# Altium schematic sheet 06_Input_1-3.SchDoc: -
size A3; Date: -; ApprovedBy: -; CheckedBy: -; Author: -; CompanyName: -; DrawnBy: -; Engineer: -; Organization: Komax AG; Address1: -; Address2: -; Address3: -; Address4: -; DocumentNumber: -; Revision: -; SheetNumber: 6; SheetTotal: 8; KSDP_ObjectName: Input 1-3; KSDP_CreatedBy: Patrick Rossacher; KSDP_CreationDate: 18.12.2017; KSDP_ModificationDate: -; KSDP_ModifiedBy: -; CurrentTime: -; CurrentDate: -; Time: -; DocumentFullPathAndName: -; DocumentName: -; ModifiedDate: -; ImagePath: -
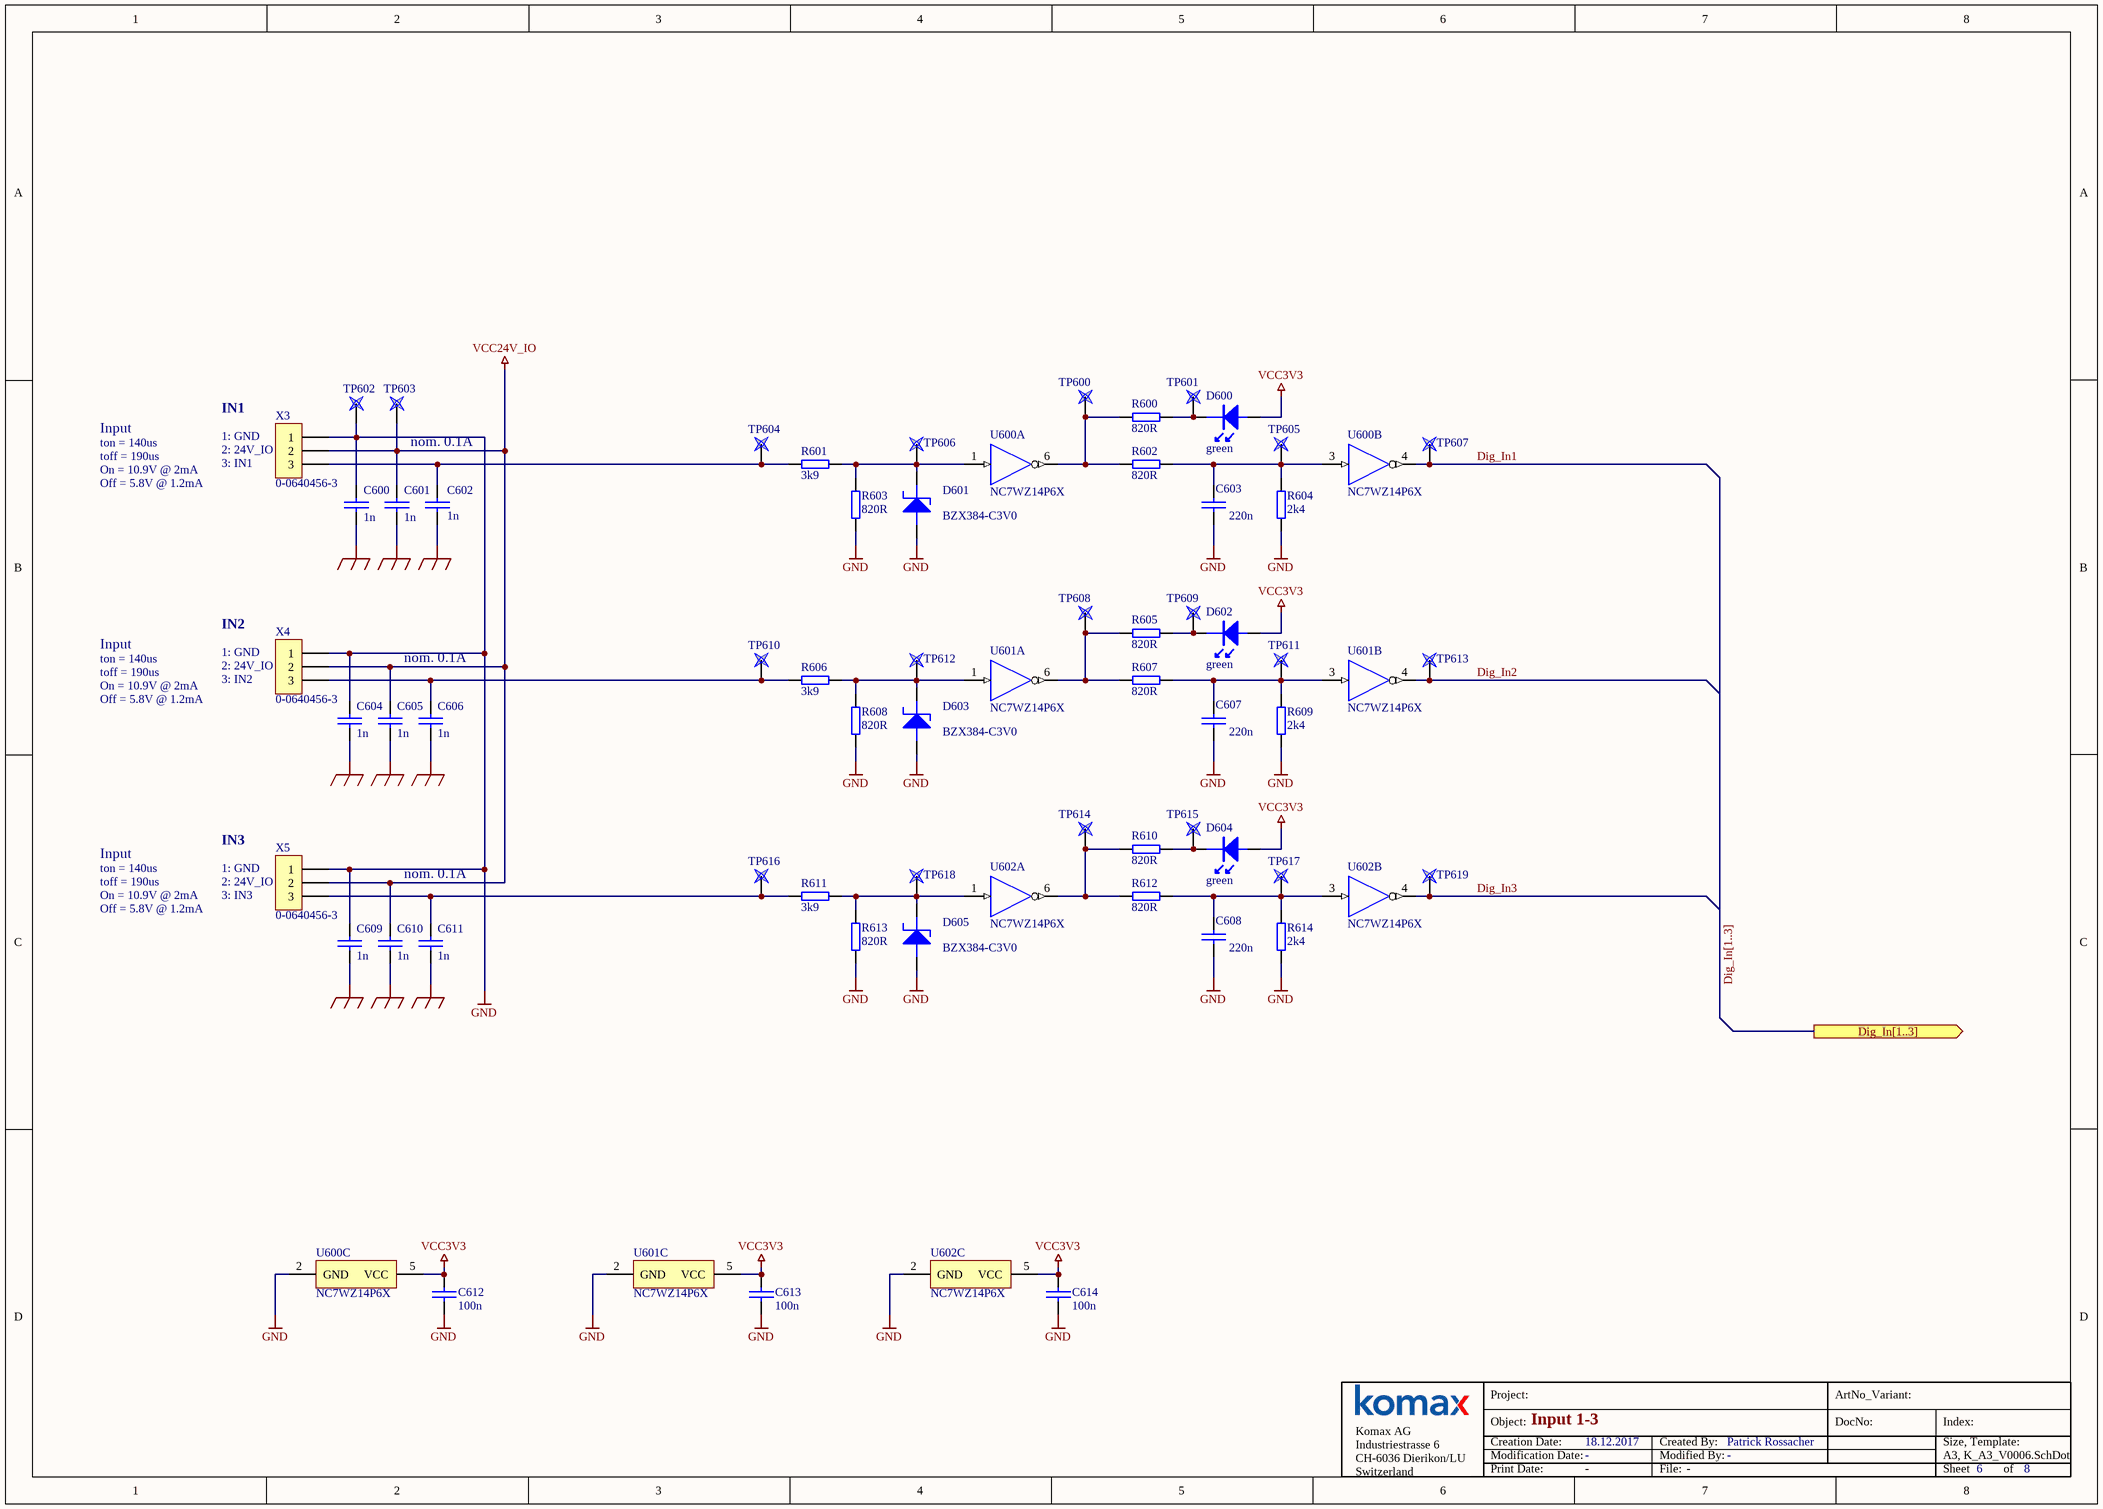
[diagram p0: 06_Input_1-3.SchDoc]

## Parts
C600  1n  [0402_c]
C601  1n  [0402_c]
C602  1n  [0402_c]
C603  220n  [0603_C]
C604  1n  [0402_c]
C605  1n  [0402_c]
C606  1n  [0402_c]
C607  220n  [0603_C]
C608  220n  [0603_C]
C609  1n  [0402_c]
C610  1n  [0402_c]
C611  1n  [0402_c]
C612  100n  [0402_C]
C613  100n  [0402_C]
C614  100n  [0402_C]
D600  color: green  [0603_led]  (hidden comment: HSMG-C190)
D601  BZX384-C3V0  [SOD-323]
D602  color: green  [0603_led]  (hidden comment: HSMG-C190)
D603  BZX384-C3V0  [SOD-323]
D604  color: green  [0603_led]  (hidden comment: HSMG-C190)
D605  BZX384-C3V0  [SOD-323]
R600  820R  [0402_R]
R601  3k9  [1206_R]
R602  820R  [0402_R]
R603  820R  [0402_R]
R604  2k4  [0402_R]
R605  820R  [0402_R]
R606  3k9  [1206_R]
R607  820R  [0402_R]
R608  820R  [0402_R]
R609  2k4  [0402_R]
R610  820R  [0402_R]
R611  3k9  [1206_R]
R612  820R  [0402_R]
R613  820R  [0402_R]
R614  2k4  [0402_R]
TP600  Testpoint  [TP1.5MM]  (value not drawn)  (no BOM)
TP601  Testpoint  [TP1.5MM]  (value not drawn)  (no BOM)
TP602  Testpoint  [TP1.5MM]  (value not drawn)  (no BOM)
TP603  Testpoint  [TP1.5MM]  (value not drawn)  (no BOM)
TP604  Testpoint  [TP1.5MM]  (value not drawn)  (no BOM)
TP605  Testpoint  [TP1.5MM]  (value not drawn)  (no BOM)
TP606  Testpoint  [TP1.5MM]  (value not drawn)  (no BOM)
TP607  Testpoint  [TP1.5MM]  (value not drawn)  (no BOM)
TP608  Testpoint  [TP1.5MM]  (value not drawn)  (no BOM)
TP609  Testpoint  [TP1.5MM]  (value not drawn)  (no BOM)
TP610  Testpoint  [TP1.5MM]  (value not drawn)  (no BOM)
TP611  Testpoint  [TP1.5MM]  (value not drawn)  (no BOM)
TP612  Testpoint  [TP1.5MM]  (value not drawn)  (no BOM)
TP613  Testpoint  [TP1.5MM]  (value not drawn)  (no BOM)
TP614  Testpoint  [TP1.5MM]  (value not drawn)  (no BOM)
TP615  Testpoint  [TP1.5MM]  (value not drawn)  (no BOM)
TP616  Testpoint  [TP1.5MM]  (value not drawn)  (no BOM)
TP617  Testpoint  [TP1.5MM]  (value not drawn)  (no BOM)
TP618  Testpoint  [TP1.5MM]  (value not drawn)  (no BOM)
TP619  Testpoint  [TP1.5MM]  (value not drawn)  (no BOM)
U600  NC7WZ14P6X  [SC70_6P]  (parts A,B,C of 3)
U601  NC7WZ14P6X  [SC70_6P]  (parts A,B,C of 3)
U602  NC7WZ14P6X  [SC70_6P]  (parts A,B,C of 3)
X3  0-0640456-3  [CON_THT_3P_MTA-100]
X4  0-0640456-3  [CON_THT_3P_MTA-100]
X5  0-0640456-3  [CON_THT_3P_MTA-100]

## Ports
Dig_In[1..3] (out)

## Nets
GND: C600.1 C603.2 C604.1 C607.2 C608.2 C609.1 C612.2 C613.2 C614.2 D601.A D603.A D605.A R603.1 R604.2 R608.1 R609.2 R613.1 R614.2 TP602.1 U600.2(GND) U601.2(GND) U602.2(GND) X3.1 X4.1 X5.1
Shield_2: C600.2 C601.2 C602.2 C604.2 C605.2 C606.1 C609.2 C610.1 C611.2
VCC3V3: C612.1 C613.1 C614.1 D600.A D602.A D604.A U600.5(VCC) U601.5(VCC) U602.5(VCC)
VCC24V_IO: C601.1 C605.1 C610.2 TP603.1 X3.2 X4.2 X5.2
Dig_In1: TP607.1 U600.4(Y)
Dig_In2: TP613.1 U601.4(Y)
Dig_In3: TP619.1 U602.4(Y)
NetC602_1: C602.1 R601.1 TP604.1 X3.3
NetC603_1: C603.1 R602.2 R604.1 TP605.1 U600.3(A)
NetC606_2: C606.2 R606.1 TP610.1 X4.3
NetC607_1: C607.1 R607.2 R609.1 TP611.1 U601.3(A)
NetC608_1: C608.1 R612.2 R614.1 TP617.1 U602.3(A)
NetC611_1: C611.1 R611.1 TP616.1 X5.3
NetD600_K: D600.K R600.1 TP601.1
NetD601_K: D601.K R601.2 R603.2 TP606.1 U600.1(A)
NetD602_K: D602.K R605.1 TP609.1
NetD603_K: D603.K R606.2 R608.2 TP612.1 U601.1(A)
NetD604_K: D604.K R610.1 TP615.1
NetD605_K: D605.K R611.2 R613.2 TP618.1 U602.1(A)
NetR600_2: R600.2 R602.1 TP600.1 U600.6(Y)
NetR605_2: R605.2 R607.1 TP608.1 U601.6(Y)
NetR610_2: R610.2 R612.1 TP614.1 U602.6(Y)

## Buses and harness runs
bus Dig_In[1..3] = port Dig_In[1..3]

## Notes on the sheet
- Input
- ton = 140us
- IN1
- (near X3) 1: GND
- (near X3) 2: 24V_IO
- nom. 0.1A
- toff = 190us
- On = 10.9V @ 2mA
- Off = 5.8V @ 1.2mA
- (near X3) 3: IN1
- IN2
- (near X4) 1: GND
- (near X4) 2: 24V_IO
- (near X4) 3: IN2
- IN3
- (near X5) 1: GND
- (near X5) 2: 24V_IO
- (near X5) 3: IN3
- Project:
- ArtNo_Variant:
- Object:
- Creation Date:
- Modification Date:
- Created By:
- Modified By:
- DocNo:
- Index:
- Size, Template:
- A3, K_A3_V0006.SchDot
- Komax AG
  Industriestrasse 6
  CH-6036 Dierikon/LU
  Switzerland
- Print Date:
- File:
- Sheet
- of

## Library data of the parts
C600-C614 = CAP: Ceramic Capacitor >=50V X7R
  C600-C602 C604-C606 C609-C614: FootprintBOM: 0402
  C603 C607 C608: FootprintBOM: 0603
D600 D602 D604 = LED: SMD LED green; Manufacturer: AVAGO; Forward Voltage: 2.2V
D601 D603 D605 = DIODEZENER: Zener Diode 3V; Manufacturer: NXP; MaxTemp: Tj +150; MinTemp: -55; FootprintBOM: SOD-323
R600 R602-R605 R607-R610 R612-R614 = RES2: Resistor 0.063W 1%; FootprintBOM: 0402
R601 R606 R611 = RES2: Resistor 0.25W 1%; FootprintBOM: 1206
TP600-TP619 = P_PRUEFPAD: FootprintBOM: Testpoint
U600-U602 = NC7WZ14P6X: Manufacturer: ON-Semi; MaxTemp: +85; MinTemp: -40; FootprintBOM: TSSOP-14
X3-X5 = CON3: MTA-100 Plug Connector 180° 3p 2.54mm; Manufacturer: AMP/TYCO; MaxTemp: +105; MinTemp: -25; FootprintBOM: THT RM=2.54mm